# EAGLE design equalizer (EAGLE 9.6.2)
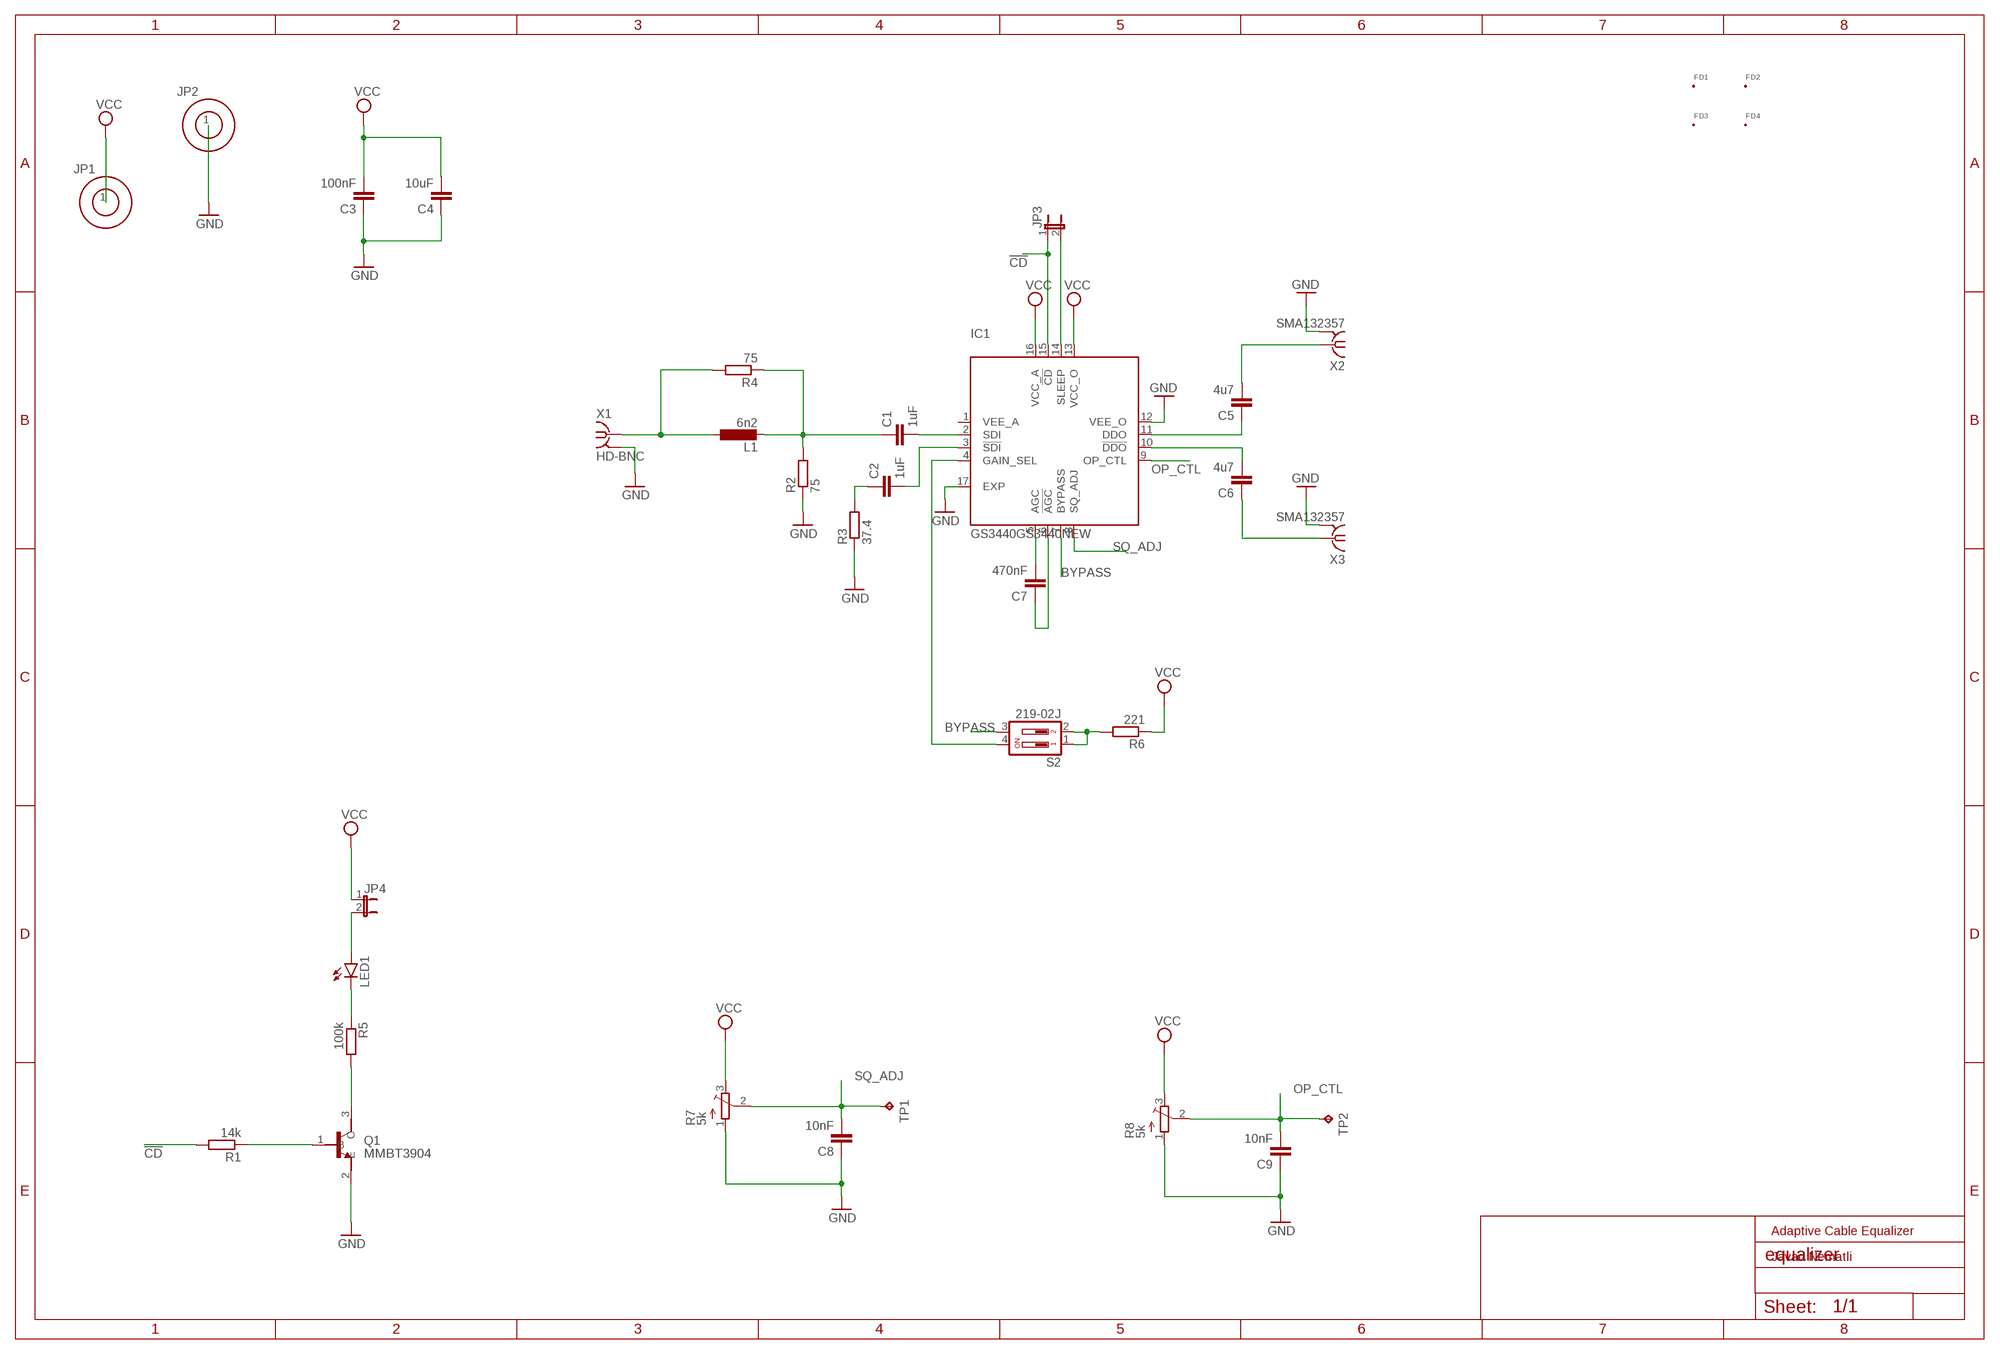
[diagram p0: schematic, sheet 1]

## Parts
C1  1uF  C0402  [0402]
C2  1uF  C0402  [0402]
C3  100nF  C0402  [0402]
C4  10uF  C0402  [0402]
C5  4u7  C0402  [0402]
C6  4u7  C0402  [0402]
C7  470nF  C0402  [0402]
C8  10nF  C0402  [0402]
C9  10nF  C0402  [0402]
FD1  FID_20MIL  [FID_020]
FD2  FID_20MIL  [FID_020]
FD3  FID_20MIL  [FID_020]
FD4  FID_20MIL  [FID_020]
IC1  GS3440GS3440NEW  [QFN65P400X400X90-17T260N]
JP1  4MMSOCKET  [4MM]
JP2  4MMSOCKET  [4MM]
JP3  JP1E  [JP1]
JP4  JP1E  [JP1]
L1  6n2  L0402  [0402]
LED1  LEDCHIP-LED0805  [CHIP-LED0805]
Q1  MMBT3904  [SOT95P240X120-3N]
R1  14k  R0402  [0402]
R2  75  R0402  [0402]
R3  37.4  R0402  [0402]
R4  75  R0402  [0402]
R5  100k  R0402  [0402]
R6  221  R0402  [0402]
R7  5k  TRIM_EU-3223W  [3223W]
R8  5k  TRIM_EU-3223W  [3223W]
S2  219-02J  [CTS-219-02J]
TP1  TPTP06R  [TP06R]
TP2  TPTP06R  [TP06R]
X1  HD-BNC  [034_1018_12G]
X2  SMA132357  [SMA]
X3  SMA132357  [SMA]

## Nets
!CD: IC1.15(!CD) JP3.1 R1.2
BYPASS: IC1.7(BYPASS) S2.3
GND: C3.1 C4.1 C8.1 C9.1 IC1.12(VEE_O) IC1.17(EXP) JP2.1 Q1.2(E) R2.1 R3.1 R7.1(A) R8.1(A) X1.G@1 X1.G@2 X1.G@3 X1.G@4 X2.G@1 X2.G@2 X2.G@3 X2.G@4 X3.G@1 X3.G@2 X3.G@3 X3.G@4
N$1 [75ohm]: C1.2 IC1.2(SDI)
N$2 [75ohm]: C1.1 L1.2 R2.2 R4.1
N$3 [75ohm]: C2.1 R3.2
N$4 [75ohm]: C2.2 IC1.3(!SDI)
N$5 [75ohm]: L1.1 R4.2 X1.P$1
N$6: C5.1 IC1.11(DDO)
N$7 [50ohm]: C5.2 X2.1
N$8: C6.2 IC1.10(!DDO)
N$9 [50ohm]: C6.1 X3.1
N$10: C7.2 IC1.5(AGC)
N$11: C7.1 IC1.6(!AGC)
N$12: Q1.1(B) R1.1
N$13: IC1.14(SLEEP) JP3.2
N$14: JP4.2 LED1.A
N$15: LED1.C R5.1
N$16: Q1.3(C) R5.2
N$17: IC1.4(GAIN_SEL) S2.4
N$18: R6.2 S2.1 S2.2
OP_CTL: C9.2 IC1.9(OP_CTL) R8.2(S) TP2.TP
SQ_ADJ: C8.2 IC1.8(SQ_ADJ) R7.2(S) TP1.TP
VCC: C3.2 C4.2 IC1.13(VCC_O) IC1.16(VCC_A) JP1.1 JP4.1 R6.1 R7.3(E) R8.3(E)

## Notes on the sheet
- Adaptive Cable Equalizer
- Javad Nematli

## Power pins joined to a net without a drawn wire
VEE_A: IC1.1(VEE_A)

## Library data of the parts
C1-C9 = labHDE_rev3:C0402
FD1-FD4 = Fiducial:FID: Fiducial marks. Top and Bottom copper with stop mask
IC1 = labHDE_rev3:GS3440: Adaptive Cable Equalizer
JP1 JP2 = labHDE_rev3:4MMSOCKET: 4MM SOCKET
JP3 JP4 = jumper:JP1E: JUMPER
L1 = labHDE_rev3:L0402
LED1 = led:LED: LED OSRAM: - CHIPLED LG R971, LG N971, LY N971, LG Q971, LY Q971, LO R971, LY R971 LH N974, LH R974 LS Q976, LO Q976, LY Q976 LO Q996 - Hyper CHIPLED LW Q18S LB Q993, LB Q99A, LB R99A - SideLED LS A670, LO A670, LY A670, LG A670, LP A670 LB A673, LV A673, LT A673, LW A673 LH A674 LY A675 LS A676, LA A676, LO A676, LY A676, LW A676 LS A679, LY A679, LG A679 - Hyper Micro SIDELED® LS Y876, LA Y876, LO Y876, LY Y876 LT Y87S - SmartLED LW L88C, LW L88S LB L89C, LB L89S, LG L890 LS L89K, LO L89K, LY L89K LS L896, LA L896, LO L896, LY L896 - TOPLED LS T670, LO T670, LY T670, LG T670, LP T670 LSG T670, LSP T670, LSY T670, LOP T670, LYG T670 LG T671, LOG T671, LSG T671 LB T673, LV T673, LT T673, LW T673 LH T674 LS T676, LA T676, LO T676, LY T676, LB T676, LH T676, LSB T676, LW T676 LB T67C, LV T67C, LT T67C, LS T67K, LO T67K, LY T67K, LW E67C LS E67B, LA E67B, LO E67B, LY E67B, LB E67C, LV E67C, LT E67C LW T67C LS T679, LY T679, LG T679 LS T770, LO T770, LY T770, LG T770, LP T770 LB T773, LV T773, LT T773, LW T773 LH T774 LS E675, LA E675, LY E675, LS T675 LS T776, LA T776, LO T776, LY T776, LB T776 LHGB T686 LT T68C, LB T68C - Hyper Mini TOPLED® LB M676 - Mini TOPLED Santana® LG M470 LS M47K, LO M47K, LY M47K Source: http://www.osram.convergy.de LUXEON: - LUMILED® LXK2-PW12-R00, LXK2-PW12-S00, LXK2-PW14-U00, LXK2-PW14-V00 LXK2-PM12-R00, LXK2-PM12-S00, LXK2-PM14-U00 LXK2-PE12-Q00, LXK2-PE12-R00, LXK2-PE12-S00, LXK2-PE14-T00, LXK2-PE14-U00 LXK2-PB12-K00, LXK2-PB12-L00, LXK2-PB12-M00, LXK2-PB14-N00, LXK2-PB14-P00, LXK2-PB14-Q00 LXK2-PR12-L00, LXK2-PR12-M00, LXK2-PR14-Q00, LXK2-PR14-R00 LXK2-PD12-Q00, LXK2-PD12-R00, LXK2-PD12-S00 LXK2-PH12-R00, LXK2-PH12-S00 LXK2-PL12-P00, LXK2-PL12-Q00, LXK2-PL12-R00 Source: www.luxeon.com KINGBRIGHT: KA-3528ASYC Source: www.kingbright.com
Q1 = MMBT3904:MMBT3904: MMBT3904 Series 40 V CE Breakdown 0.2 A NPN General Purpose Amplifier - SOT-23 Check availability <https://pricing.snapeda.com/parts/MMBT3904/STMicroelectronics/view-part?ref=eda>; AVAILABILITY: Not in stock; DESCRIPTION: Bipolar (BJT) Transistor NPN 40V 200mA 300MHz 300mW Surface Mount SOT-23-3; MF: STMicroelectronics; MP: MMBT3904; PACKAGE: SOT-23 ON; PRICE: None
R1-R6 = labHDE_rev3:R0402
R7 R8 = pot:TRIM_EU-: POTENTIOMETER
S2 = switch-dil:219-02*: Surface Mount DIP Switch Series 219 SMT CTS Electronic Components Sourc: www.ctscorp.com; OC_FARNELL: unknown; OC_NEWARK: unknown
TP1 TP2 = testpad:TP: Test pad
X1 = labHDE_rev3:HD-BNC: HD BNC 75 Ohm AMPHENOL RF
X2 X3 = labHDE_rev3:SMA: SMA 50 Ohm End Launch Jack Receptacle - Round Contact AMPHENOL RF

## Net classes
1 50ohm: width 0.714 mm
2 75ohm: width 0.337 mm

## Board
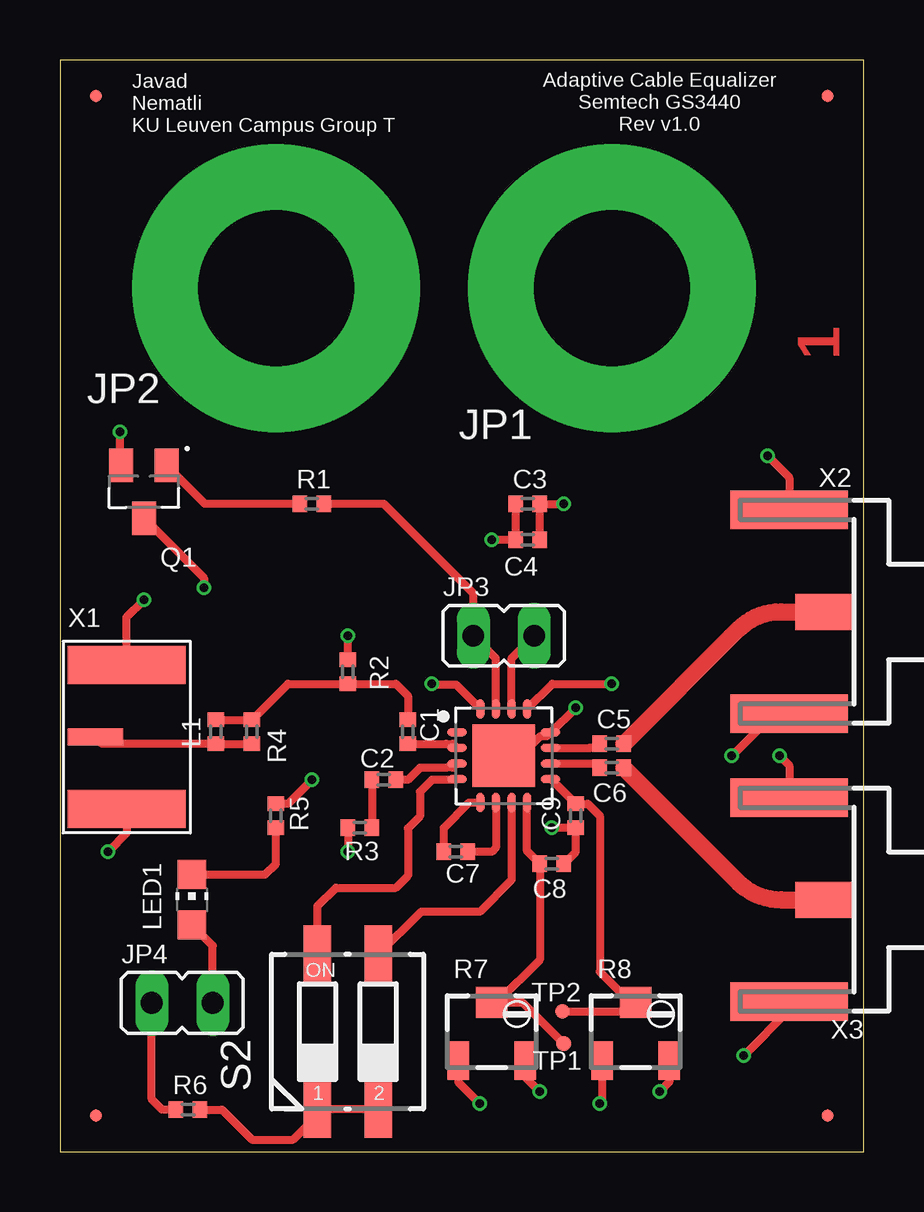
[diagram p1: board, top side]
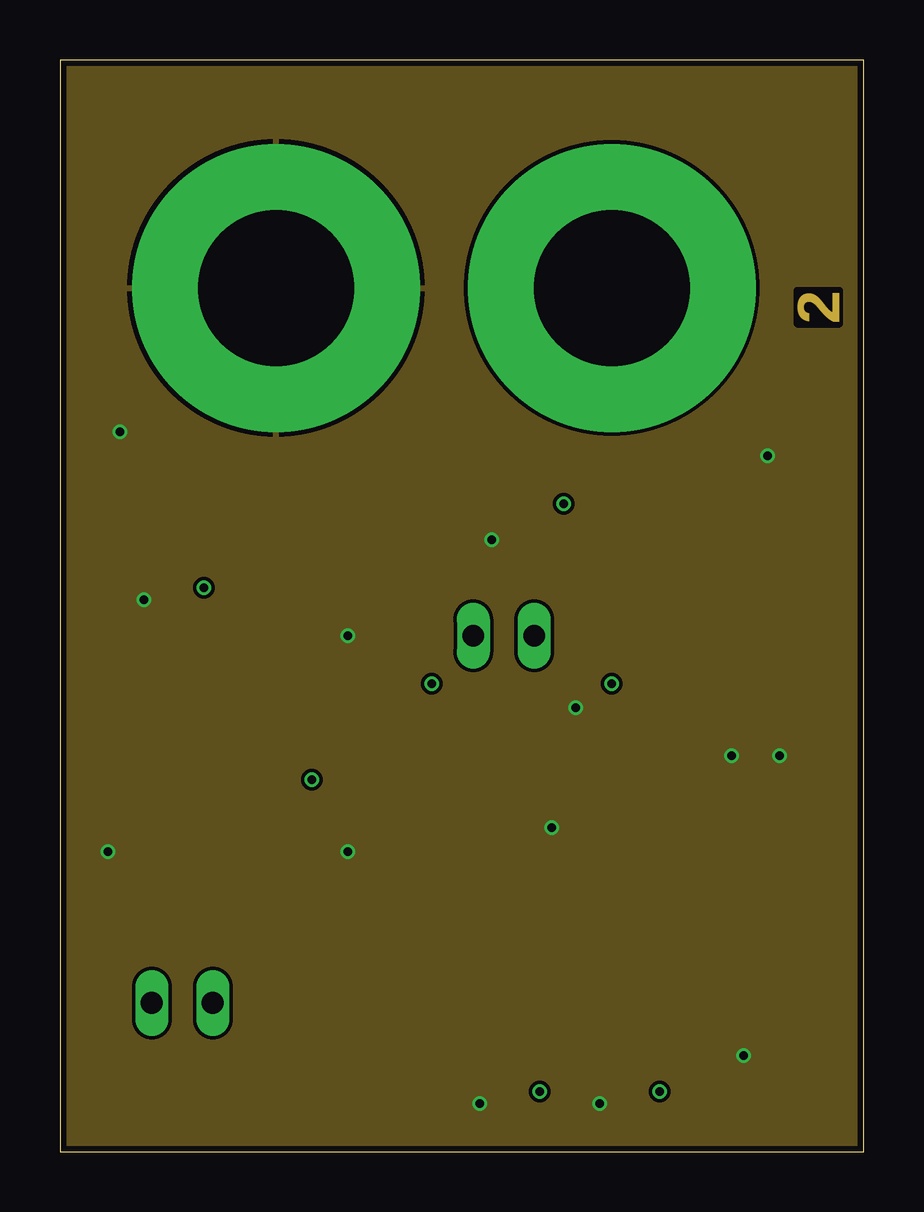
[diagram p2: board, inner layer GND]
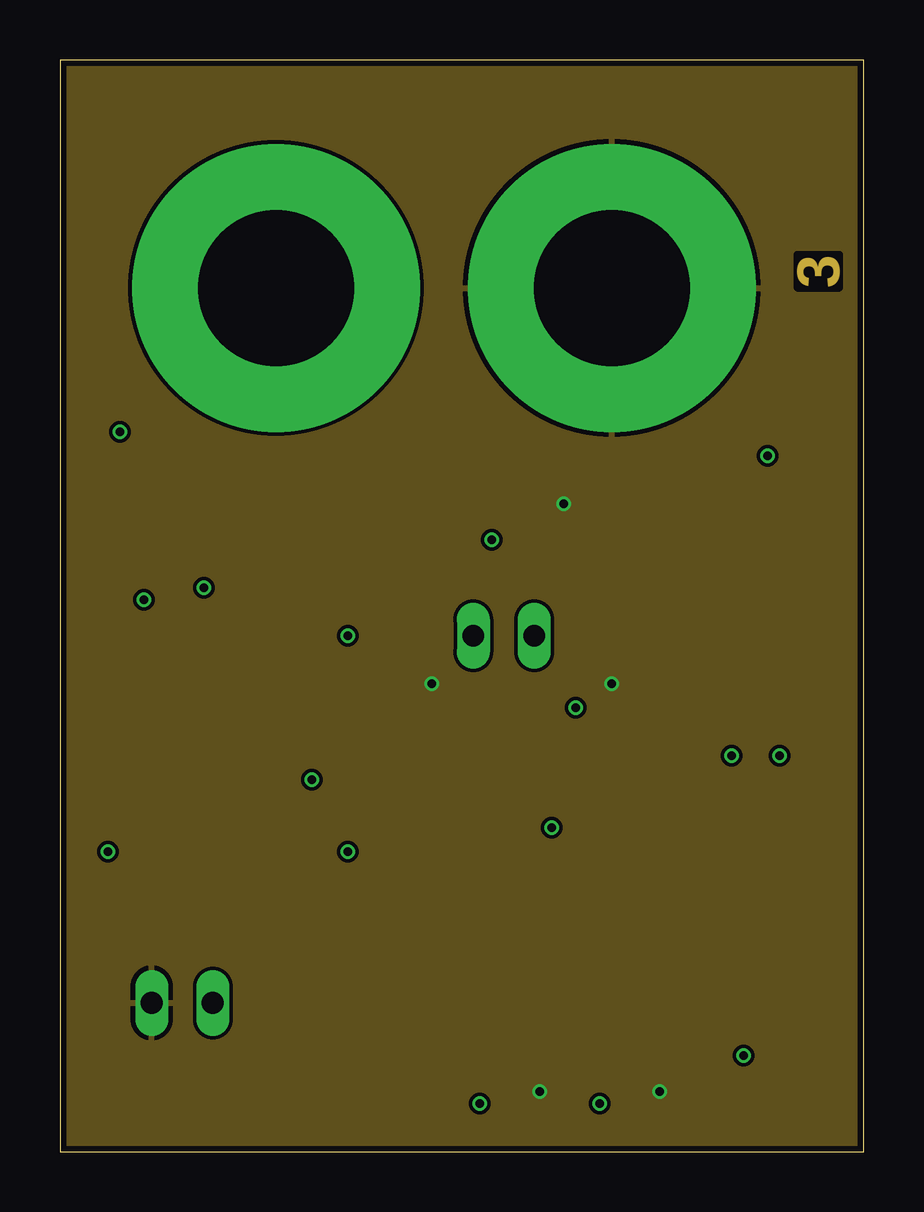
[diagram p3: board, inner layer VCC]
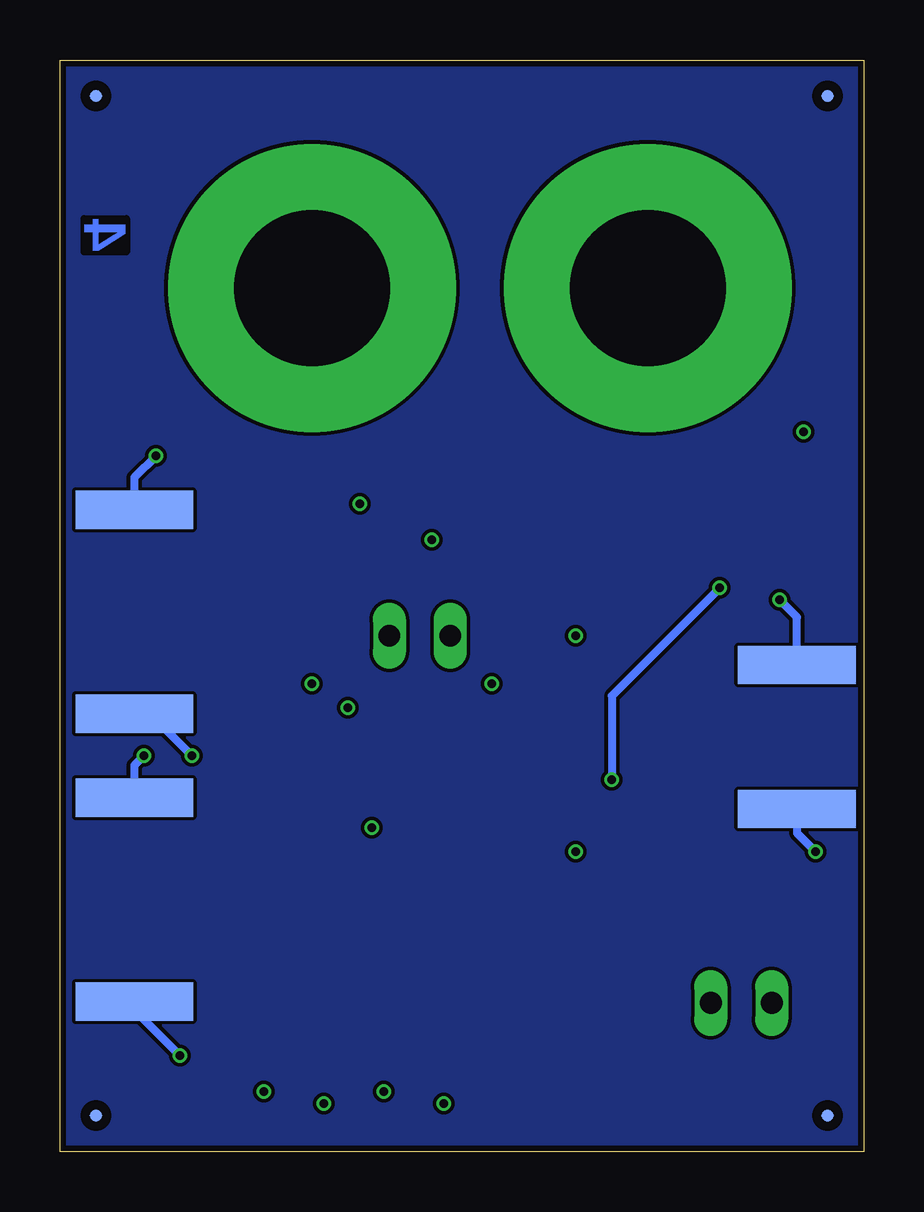
[diagram p4: board, bottom side, seen from below]

Size 33.5 x 45.5 mm. Coordinates in mm from the lower left corner, seen from the top.
Outline: 0,0 33.5,0 33.5,45.5 0,45.5 0,0
Copper layers (1+2*15+16): Top 0.018mm / dielectric 0.4mm / GND 0.035mm / dielectric 0.71mm / VCC 0.035mm / dielectric 0.4mm / Bottom 0.018mm
Design rules "4Layer_PClass6 *": minimum track width 0.15mm, minimum drill 0.35mm, track to track 0.15mm, track to pad 0.15mm, pad to pad 0.15mm, via to via 0.15mm, smd to smd 0mil, copper to edge 0.25mm, drill to drill 0.35mm, minimum pad ring 0.175mm, minimum via ring 0.125mm, stop-mask expansion 0mil, vias tented up to drill 0.45mm, thermal gap 0.2mm

### Footprints (pad centres in the part's own frame; a part is rotated, then mirrored left to right if it is on the bottom)
0402 = smd 0.6 x 0.7: 1 -0.5,0; 2 0.5,0
FID_020 = smd 0.508 x 0.508 bottom: FIDB 0,0 | smd 0.508 x 0.508: FIDT 0,0
QFN65P400X400X90-17T260N = smd 0.812 x 0.332: 1 -1.95,0.975; 2 -1.95,0.325; 3 -1.95,-0.325; 4 -1.95,-0.975; 9 1.95,-0.975; 10 1.95,-0.325; 11 1.95,0.325; 12 1.95,0.975 | smd 0.332 x 0.812: 5 -0.975,-1.95; 6 -0.325,-1.95; 7 0.325,-1.95; 8 0.975,-1.95; 13 0.975,1.95; 14 0.325,1.95; 15 -0.325,1.95; 16 -0.975,1.95 | smd 2.6 x 2.6: 17 0,0
4MM = drill 6.5 pad 12: 1 0,0
JP1 = drill 0.914 long: 1 0,-1.27; 2 0,1.27
CHIP-LED0805 = smd 1.2 x 1.2: A 0,-1.05; C 0,1.05
SOT95P240X120-3N = smd 1 x 1.4: 1 -0.95,-1.1; 2 0.95,-1.1; 3 0,1.1
3223W = smd 0.9 x 1.6: 1 -1.4,-1.215; 3 1.4,-1.215 | smd 1.3 x 1.3: 2 0,1.215
CTS-219-02J = smd 1.13 x 2.44: 1 -1.27,-3.215; 2 1.27,-3.215; 3 1.27,3.215; 4 -1.27,3.215
TP06R = smd 0.6 x 0.6: TP 0,0
034_1018_12G = smd 1.58 x 4.9: G@1 -3,2.45; G@2 3,2.45 | smd 1.58 x 4.9 bottom: G@3 -3,2.45; G@4 3,2.45 | smd 0.7 x 2.3: P$1 0,1.15
SMA = smd 2.35 x 1.5: 1 1.175,0 | smd 4.9 x 1.6: G@1 2.6,4.25; G@2 2.6,-4.25 | smd 4.9 x 1.6 bottom: G@3 2.6,4.25; G@4 2.6,-4.25

### Placement (x,y rotation side)
C1  14.5,17.5 270 top
C2  13.5,15.5 0 top
C3  19.5,27 0 top
C4  19.5,25.5 0 top
C5  23,17 0 top
C6  23,16 180 top
C7  16.5,12.5 180 top
C8  20.5,12 180 top
C9  21.5,14 90 top
FD1  32,44 0 top
FD2  1.5,44 0 top
FD3  1.5,1.5 0 top
FD4  32,1.5 0 top
IC1  18.5,16.5 0 top
JP1  23,36 0 top
JP2  9,36 0 top
JP3  18.5,21.5 270 top
JP4  5.1,6.19 270 top
L1  6.5,17.5 90 top
LED1  5.5,10.5 0 top
Q1  3.5,27.5 180 top
R1  10.5,27 0 top
R2  12,20 270 top
R3  12.5,13.5 0 top
R4  8,17.5 270 top
R5  9,14 90 top
R6  5.34,1.75 0 top
R7  18,5 0 top
R8  24,5 0 top
S2  12,5 0 top
TP1  21,4.5 0 top
TP2  20.95,5.85 0 top
X1  0.33,17.28 270 top
X2  33,22.5 180 top
X3  33,10.5 180 top

### Tracks (layer width: path | path; a pad name or v marks a point on that pad's centre or on a via)
!CD
  Top 0.337: IC1.15 18.17,20.55 JP3.1 17.23,23.27 13.5,27 R1.2
BOTTOM
  pour Bottom: 0,45.5 33.5,45.5 33.5,0 0,0
BYPASS
  Top 0.337: S2.3 15.06,10 17.5,10 18.83,11.33 IC1.7
GND  (via drill 0.35)
  Top 0.337: v29.5,29 30.4,28.1 X2.G@4 | X2.G@3 29.75,18.25 v28,16.5 | v30,16.5 30.4,16.1 X3.G@4 | X3.G@3 30.4,5.9 v28.5,4 | X1.G@3 2.78,22.28 v3.5,23 | X1.G@4 2.78,13.28 v2,12.5 | Q1.2 2.5,28.65 v2.5,30 | C3.1 C4.1 v18,25.5 | R3.1 v12,12.5 | R2.1 v12,21.5 | R8.1 22.6,2.1 v22.5,2 | C8.1 21.5,12.5 C9.1 v20.5,13.5 | R7.1 16.6,2.9 v17.5,2 | v21.5,18.5 20.47,17.48 IC1.12 20.29,17.31 20.01,17.31 19.2,16.5 IC1.17
  Bottom 0.337: X3.G@3 30.4,5.9 v28.5,4 | v30,16.5 30.4,16.1 X3.G@4 | X2.G@3 29.75,18.25 v28,16.5 | v29.5,29 30.4,28.1 X2.G@4 | X1.G@3 2.78,22.28 v3.5,23 | X1.G@4 2.78,13.28 v2,12.5
  pour GND: 0,45.5 33.5,45.5 33.5,0 0,0
N$1
  Top 0.337: C1.2 16.1,17 16.11,16.99 16.39,16.99 IC1.2
N$2
  Top 0.337: L1.2 R4.1 9.5,19.5 R2.2 14,19.5 14.5,19 C1.1
N$3
  Top 0.337: C2.1 R3.2
N$4
  Top 0.337: IC1.3 16.39,16.01 16.11,16.01 16.1,16 15,16 14.5,15.5 C2.2
N$5
  Top 0.337: X1.P$1 1.76,17 L1.1 R4.2
N$6
  Top 0.337: IC1.11 22.08,16.83 arc45 C5.1
N$7
  Top 0.714: C5.2 28.26,21.76 arc-45 30.05,22.5 X2.1
N$8
  Top 0.337: IC1.10 22.08,16.17 arc-45 C6.2
N$9
  Top 0.714: C6.1 28.26,11.24 arc45 30.05,10.5 X3.1
N$10
  Top 0.337: C7.2 16,13.5 17.05,14.55 IC1.5
N$11
  Top 0.337: IC1.6 18.17,12.67 18,12.5 C7.1
N$12
  Top 0.337: R1.1 6.05,27 Q1.1
N$13
  Top 0.337: IC1.14 18.83,20.55 JP3.2
N$14
  Top 0.337: JP4.2 6.37,8.58 LED1.A
N$15
  Top 0.337: LED1.C 8.55,11.55 9,12 R5.1
N$16  (via drill 0.35)
  Top 0.337: Q1.3 6,23.9 v6,23.5 | v10.5,15.5 9.5,14.5 R5.2
  Bottom 0.337: v6,23.5 10.5,19 v10.5,15.5
N$17
  Top 0.337: S2.4 10.73,10.23 11.5,11 14,11 14.5,11.5 14.5,13.47 15,13.97 15,15 15.5,15.5 16.53,15.5 IC1.4
N$18
  Top 0.337: R6.2 6.75,1.75 8,0.5 9.72,0.5 11,1.78 | S2.1 11,1.78 | 11,1.78 S2.2
OP_CTL
  Top 0.337: TP2.TP 23.64,5.85 R8.2 23.78,6.22 22.5,7.5 22.5,14 22,14.5 C9.2 20.47,15.52 IC1.9
SQ_ADJ
  Top 0.337: IC1.8 19.47,12.52 C8.2 20,8 18.22,6.22 R7.2 19.28,6.22 TP1.TP
VCC  (via drill 0.35)
  Top 0.337: R6.1 4.25,1.75 3.83,2.17 JP4.1 | C4.2 C3.2 v21,27 | R7.3 19.4,3.1 v20,2.5 | R8.3 25.4,2.9 v25,2.5 | IC1.13 20.53,19.5 v23,19.5 | IC1.16 16.53,19.45 15.55,19.45 v15.5,19.5
  pour VCC: 0,45.5 33.5,45.5 33.5,0 0,0

### Text on the board
Top: 1
GND: 2
VCC: 3
Bottom: 4
tPlace: Javad / Nematli / KU Leuven Campus Group T | Adaptive Cable Equalizer / Semtech GS3440 / Rev v1.0
Document: 4-Layer STD Build 1.6mm (1.616mm before plating, 1.65mm after) | Layer 1 - TOP -> 18um (1/2 oz) copper | 400um Isola IS400 2x7268 prepreg -> Epsilon_r 4.35@2GHz | Layer 2 - GND -> 35um (1 oz) copper | 710um Isola IS400 4x7268core -> Epsilon_r 4.48@2GHz | Layer 15 - VCC -> 35um (1 oz) copper | 400um Isola IS400 2x7268 prepreg -> Epsilon_r 4.35@2GHz | Layer 16 - BOTTOM -> 18um (1/2 oz) copper | XV501T DI soldermask -> Epsilon_r 3.95@1MHz | Surface Microstrip Impedance Control: / / 50 Ohm - 713.5185µm / 75 Ohm - 337.35034µm